# Altium schematic sheet 98.Power Test.SchDoc
size 297 x 209 mm; Revision: V2.1; Schematic Page Number: 11; Page Number: 42; Check: <Checker>; Schematic Name: RK_NVR_DEMO1_RK3588_LP4/4x_V21; Page Count: 43; Page name: 98.Power Test; Designer: Zhangdz; Schematic Page Count: 99; Revcode: V2.1; DsnPath: E:\Work\SBER\RK3588_SOM\temp\RK_NVR_DEMO1_RK3588_LP4XD200P232SD8_V21_20211228.DSN; SchematicName: RK_NVR_DEMO1_RK3588_LP4/4x_V21; PageName: 98.Power Test; PageSize: A4; TopSchematic: True
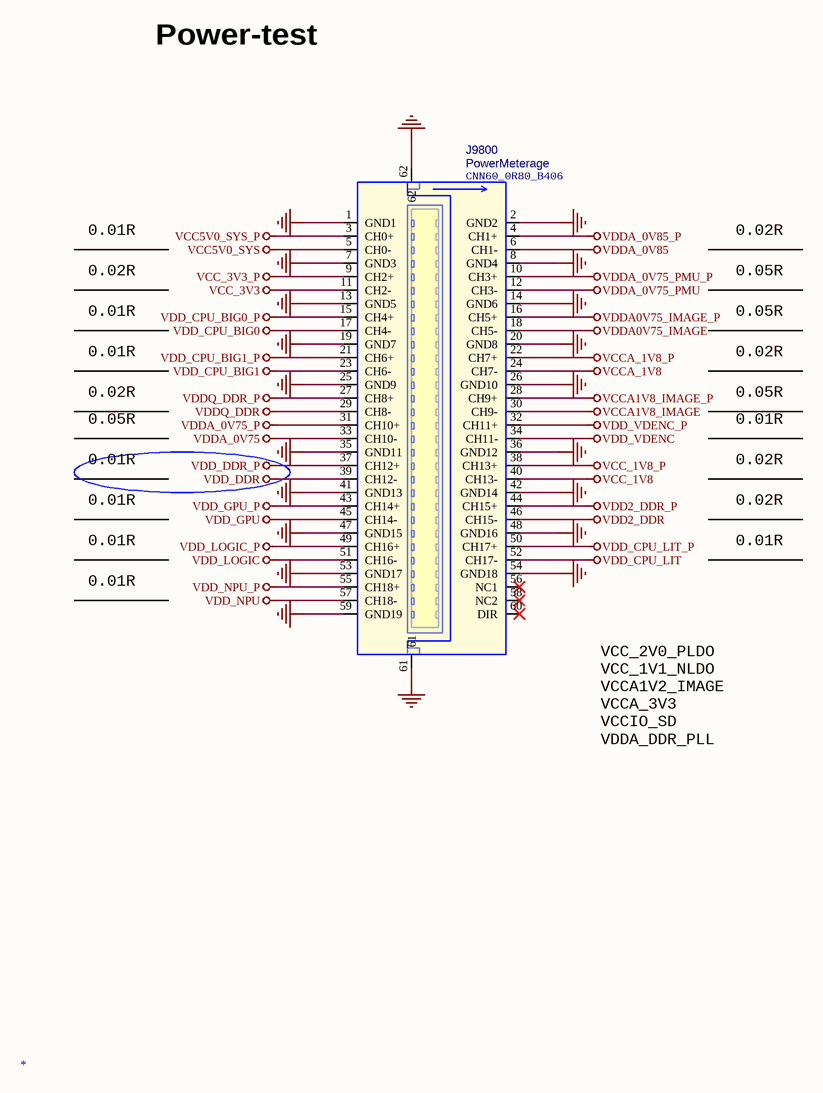
[diagram p0: 98.Power Test.SchDoc]

## Parts
J9800  *  [CNN60_0R80_B406]

## Nets
GND: J9800.1(GND1) J9800.2(GND2) J9800.7(GND3) J9800.8(GND4) J9800.13(GND5) J9800.14(GND6) J9800.19(GND7) J9800.20(GND8) J9800.25(GND9) J9800.26(GND10) J9800.35(GND11) J9800.36(GND12) J9800.41(GND13) J9800.42(GND14) J9800.47(GND15) J9800.48(GND16) J9800.53(GND17) J9800.54(GND18) J9800.59(GND19) J9800.61 J9800.62
VCC5V0_SYS: J9800.5(CH0-)
VCC5V0_SYS_P: J9800.3(CH0+)
VCC_1V8: J9800.40(CH13-)
VCC_1V8_P: J9800.38(CH13+)
VCC_3V3: J9800.11(CH2-)
VCC_3V3_P: J9800.9(CH2+)
VCCA1V8_IMAGE: J9800.30(CH9-)
VCCA1V8_IMAGE_P: J9800.28(CH9+)
VCCA_1V8: J9800.24(CH7-)
VCCA_1V8_P: J9800.22(CH7+)
VDD2_DDR: J9800.46(CH15-)
VDD2_DDR_P: J9800.44(CH15+)
VDD_CPU_BIG0: J9800.17(CH4-)
VDD_CPU_BIG0_P: J9800.15(CH4+)
VDD_CPU_BIG1: J9800.23(CH6-)
VDD_CPU_BIG1_P: J9800.21(CH6+)
VDD_CPU_LIT: J9800.52(CH17-)
VDD_CPU_LIT_P: J9800.50(CH17+)
VDD_DDR: J9800.39(CH12-)
VDD_DDR_P: J9800.37(CH12+)
VDD_GPU: J9800.45(CH14-)
VDD_GPU_P: J9800.43(CH14+)
VDD_LOGIC: J9800.51(CH16-)
VDD_LOGIC_P: J9800.49(CH16+)
VDD_NPU: J9800.57(CH18-)
VDD_NPU_P: J9800.55(CH18+)
VDD_VDENC: J9800.34(CH11-)
VDD_VDENC_P: J9800.32(CH11+)
VDDA0V75_IMAGE: J9800.18(CH5-)
VDDA0V75_IMAGE_P: J9800.16(CH5+)
VDDA_0V75: J9800.33(CH10-)
VDDA_0V75_P: J9800.31(CH10+)
VDDA_0V75_PMU: J9800.12(CH3-)
VDDA_0V75_PMU_P: J9800.10(CH3+)
VDDA_0V85: J9800.6(CH1-)
VDDA_0V85_P: J9800.4(CH1+)
VDDQ_DDR: J9800.29(CH8-)
VDDQ_DDR_P: J9800.27(CH8+)

Not connected (* = marked no-connect by the designer): J9800 56(NC1)* 58(NC2)* 60(DIR)*

## Notes on the sheet
- Power-test
- 0.02R
- 0.01R
- 0.05R
- VCC_2V0_PLDO
  VCC_1V1_NLDO
  VCCA1V2_IMAGE
  VCCA_3V3
  VCCIO_SD
  VDDA_DDR_PLL

## Library data of the parts
J9800 = PowerMeasurement_6: Part Reference: J9800; Value: PowerMeterage; PCB Footprint: CNN60_0R80_B406